# Altium schematic sheet Esp8266.SchDoc
size A3; SheetNumber: 5; SheetTotal: 8
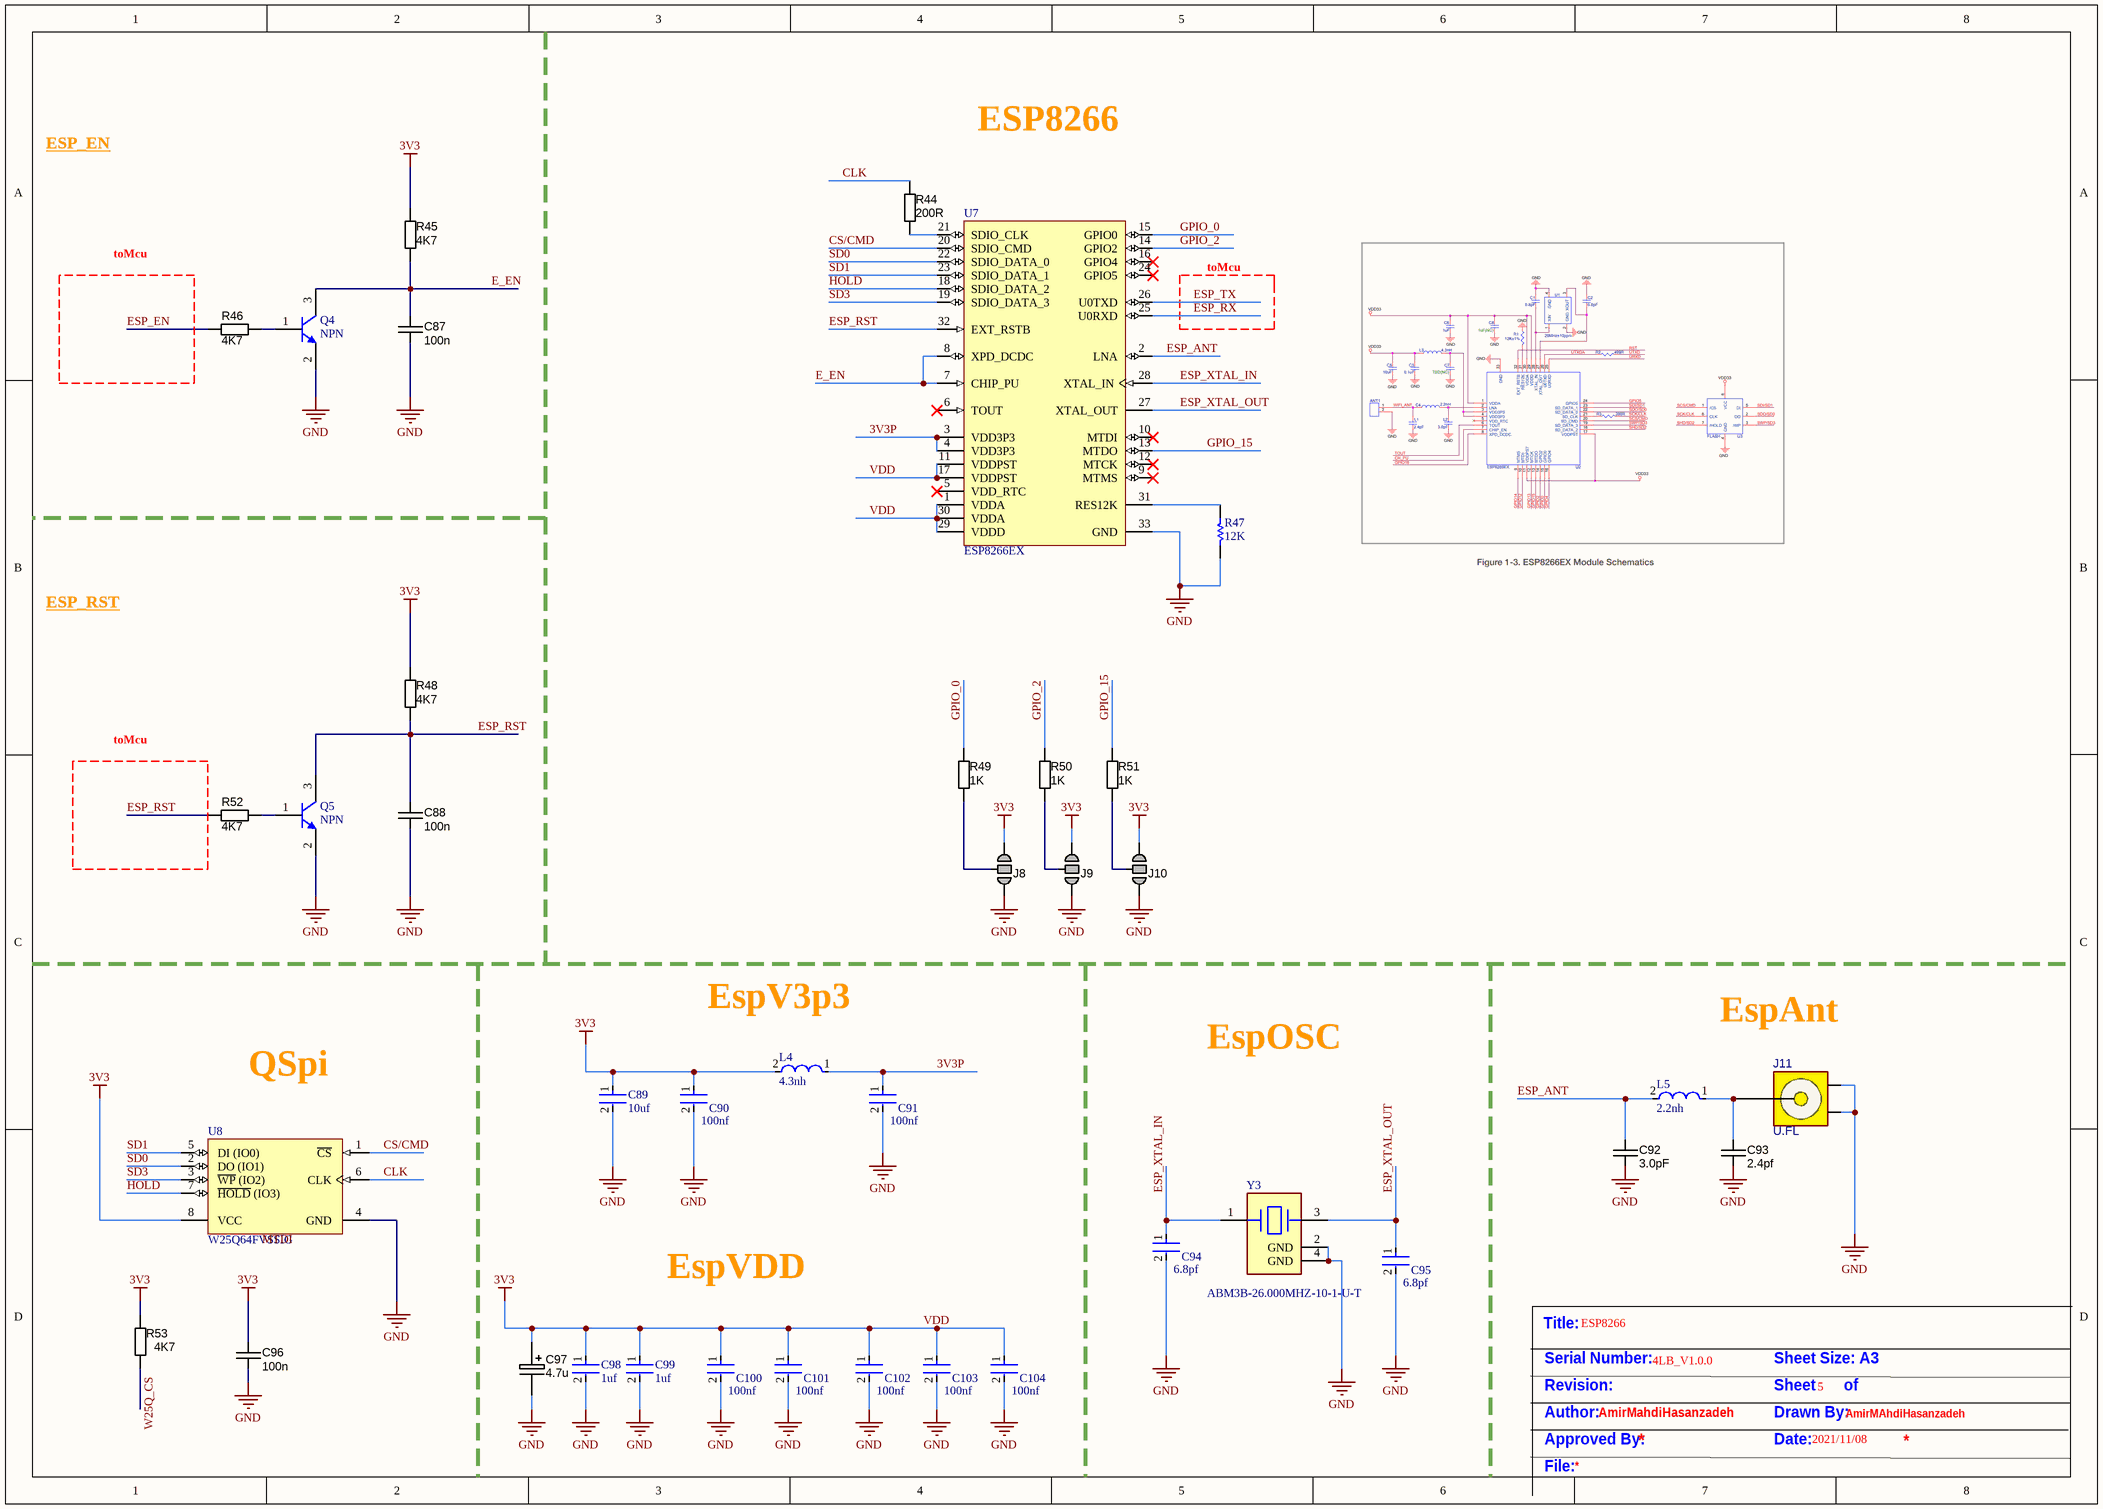
[diagram p0: Esp8266.SchDoc]

## Parts
C87  value 100n  [CAPC1608X90N]  (hidden comment: approved sub OK)
C88  value 100n  [CAPC1608X90N]  (hidden comment: approved sub OK)
C89  10uf  [FP-GRM31C-0_2-e0_3_0_8-MFG]
C90  100nf  [FP-CGA3E-0_3-0_1-IPC_A]
C91  100nf  [FP-CGA3E-0_3-0_1-IPC_A]
C92  3.0pF  [C0402]
C93  value 2.4pf  [C0402]  (hidden comment: approved sub OK)
C94  6.8pf  [FP-CGA3E-0_3-0_1-IPC_A]
C95  6.8pf  [FP-CGA3E-0_3-0_1-IPC_A]
C96  value 100n  [CAPC1608X90N]  (hidden comment: approved sub OK)
C97  value 4.7u  [C_TN_3528]
C98  1uf  [FP-GRM31C-0_2-e0_3_0_8-MFG]
C99  1uf  [FP-GRM31C-0_2-e0_3_0_8-MFG]
C100  100nf  [FP-CGA3E-0_3-0_1-IPC_A]
C101  100nf  [FP-CGA3E-0_3-0_1-IPC_A]
C102  100nf  [FP-CGA3E-0_3-0_1-IPC_A]
C103  100nf  [FP-CGA3E-0_3-0_1-IPC_A]
C104  100nf  [FP-CGA3E-0_3-0_1-IPC_A]
J8  Jumper  [Jump_3Way]  (value not drawn)  (no BOM)
J9  Jumper  [Jump_3Way]  (value not drawn)  (no BOM)
J10  Jumper  [Jump_3Way]  (value not drawn)  (no BOM)
J11  U.FL  [UFL]
L4  4.3nh  [FP-CBMF1608-MFG]
L5  2.2nh  [FP-CBMF1608-MFG]
Q4  NPN  [SOT23-3]
Q5  NPN  [SOT23-3]
R44  value 200R  [RESC1608X55N]  (hidden comment: Thick Film)
R45  value 4K7  [RESC1608X55N]  (hidden comment: Thick Film)
R46  value 4K7  [RESC1608X55N]  (hidden comment: Thick Film)
R47  12K  [RESC1608X55X25ML10T15]
R48  value 4K7  [RESC1608X55N]  (hidden comment: Thick Film)
R49  value 1K  [RESC1608X55N]  (hidden comment: Thick Film)
R50  value 1K  [RESC1608X55N]  (hidden comment: Thick Film)
R51  value 1K  [RESC1608X55N]  (hidden comment: Thick Film)
R52  value 4K7  [RESC1608X55N]  (hidden comment: Thick Film)
R53  value 4K7  [RESC1608X55N]  (hidden comment: Thick Film)
U7  ESP8266EX  [ESFS-QFN-32_L]
U8  W25Q64FVSSIG  [WINB-SOIC-8_M]
Y3  ABM3B-26.000MHZ-10-1-U-T  [FP-ABM3B-MFG]

## Nets
GND: C87.2 C88.2 C89.2 C90.2 C91.2 C92.2 C93.2 C94.2 C95.2 C96.2 C97.2 C98.2 C99.2 C100.2 C101.2 C102.2 C103.2 C104.2 J8.1 J9.1 J10.1 J11.2(G1) J11.3(G2) Q4.2(E) Q5.2(E) R47.1 U7.33(GND) U8.4(GND) Y3.2(GND) Y3.4(GND)
VDD: C89.1 C90.1 C96.1 C97.1 C98.1 C99.1 C100.1 C101.1 C102.1 C103.1 C104.1 J8.3 J9.3 J10.3 L4.2 R45.1 R48.1 R53.1 U7.1(VDDA) U7.11(VDDPST) U7.17(VDDPST) U7.29(VDDD) U7.30(VDDA) U8.8(VCC)  [also labelled 3V3]
3V3P: C91.1 L4.1 U7.3(VDD3P3) U7.4(VDD3P3)
CLK: R44.2 U8.6(CLK)
CS/CMD: U7.20(SDIO_CMD) U8.1(~{CS})
E_EN: C87.1 Q4.3(C) R45.2 U7.7(CHIP_PU) U7.8(XPD_DCDC)
ESP_ANT: C92.1 L5.2 U7.2(LNA)
ESP_EN: R46.1
ESP_RST: C88.1 Q5.3(C) R48.2 R52.1 U7.32(EXT_RSTB)
ESP_RX: U7.25(U0RXD)
ESP_TX: U7.26(U0TXD)
ESP_XTAL_IN: C94.1 U7.28(XTAL_IN) Y3.1
ESP_XTAL_OUT: C95.1 U7.27(XTAL_OUT) Y3.3
GPIO_0: R49.1 U7.15(GPIO0)
GPIO_2: R50.1 U7.14(GPIO2)
GPIO_15: R51.1 U7.13(MTDO)
HOLD: U7.18(SDIO_DATA_2) U8.7(~{HOLD}_(IO3))
SD0: U7.22(SDIO_DATA_0) U8.2(DO_(IO1))
SD1: U7.23(SDIO_DATA_1) U8.5(DI_(IO0))
SD3: U7.19(SDIO_DATA_3) U8.3(~{WP}_(IO2))
W25Q_CS: R53.2
NetC93_1: C93.1 J11.1(SIG) L5.1
NetJ8_2: J8.2 R49.2
NetJ9_2: J9.2 R50.2
NetJ10_2: J10.2 R51.2
NetQ4_1: Q4.1(B) R46.2
NetQ5_1: Q5.1(B) R52.2
NetR44_1: R44.1 U7.21(SDIO_CLK)
NetR47_2: R47.2 U7.31(RES12K)

Not connected (* = marked no-connect by the designer): U7 5(VDD_RTC)* 6(TOUT)* 9(MTMS)* 10(MTDI)* 12(MTCK)* 16(GPIO4)* 24(GPIO5)*

## Notes on the sheet
- ESP_EN
- ESP8266
- toMcu
- ESP_RST
- EspV3p3
- EspOSC
- EspAnt
- QSpi
- EspVDD
- Labels drawn without touching a wire or pin: MTDI
- Title:
- Serial Number:
- Revision:
- 4LB_V1.0.0
- Sheet       of
- Sheet Size: A3
- 5
- Author:
- Approved By:
- AmirMahdiHasanzadeh
- Date:
- Drawn By:
- 2021/11/08
- AmirMAhdiHasanzadeh
- File:

## Library data of the parts
C87 C88 C93 C96 = CAPC_100n_0603_X7R_50V_10%: Capacitor SMD Cer 100nF 10% 50V X7R 0603; Manufacturer 1: AVX Corporation; Manufacturer Part Number 1: 06035C104KAT2A; Ratings: 50V; X7R; Material: ceramic; SCDType: spec; Manufacturer 2: TDK Corporation; Manufacturer Part Number 2: C1608X7R1H104K; Package / Case: 0603 (1608 Metric); Tolerance: ±10%; Supplier 1: Digi-Key; Supplier Part Number 1: 478-5052-1-ND; ComponentLink1URL: http://www.avx.com/docs/Catalogs/cx7r.pdf; ComponentLink1Description: http://www.avx.com/docs/Catalogs/cx7r.pdf; Supplier 2: Digi-Key; Supplier Part Number 2: 445-1314-1-ND; ComponentLink2URL: http://product.tdk.com/capacitor/mlcc/en/documents/mlcc_commercial_general_en.pdf; ComponentLink2Description: http://product.tdk.com/capacitor/mlcc/en/documents/mlcc_commercial_general_en.pdf
C89 C98 C99 = CMP-06035-003841-1: Chip Multilayer Ceramic Capacitors for General Purpose, 1206, 10uF, X7R, 15%, 10%, 10V; Capacitance: 22uF; Height: 1.6mm; Width: 0.063inch; Min Operating Temperature: -55°C; Package Quantity: 1; Termination: SMD/SMT; Length: 3.2mm; Voltage Rating: 10V; Case/Package: 1206; Case Code (Imperial): 1206; Depth: 1.6mm; Dielectric: X7R; Voltage: 10V; Material: Ceramic; Tolerance: 10%; Voltage Rating (DC): 10V; Lead Free: Lead Free; Max Operating Temperature: 125°C; Case Code (Metric): 3216; Packaging: Tape and Reel; Thickness: 0.071inch; Radiation Hardening: No; REACH SVHC: No SVHC; Mount: Surface Mount
C90 C91 C94 C95 C100-C104 = CMP-2000-07546-2: Cap Ceramic 100nF 50V X7R 10% Pad SMD 0603 +125°C Automotive T/R; Weight: 7.1E-05oz; Composition: Ceramic; Max Operating Temperature: 125°C; Termination: SMD/SMT; Dielectric: X7R; Length: 1.6mm; Package Quantity: 1; REACH SVHC: No SVHC; Lead Free: Lead Free; Case Code (Metric): 1608; Min Operating Temperature: -55°C; Packaging: Tape and Reel; Tolerance: 10%; Voltage Rating: 50V; Case Code (Imperial): 0603; Capacitance: 100nF; Case/Package: 0603; Voltage Rating (DC): 50V; Depth: 0.8mm; Radiation Hardening: No; Ratings: AEC-Q200; Mount: Surface Mount; Voltage: 50V; Thickness: 0.035inch; Width: 0.8mm; Height: 0.8mm
C92 = CAPC_100n_0603_X7R_50V_10%: Capacitor SMD Cer 3.0pF 10% 50V X7R 0603; Manufacturer 1: AVX Corporation; Manufacturer Part Number 1: 06035C104KAT2A; Ratings: 50V; X7R; Material: ceramic; SCDType: spec; Manufacturer 2: TDK Corporation; Manufacturer Part Number 2: C1608X7R1H104K; Package / Case: 0603 (1608 Metric); Tolerance: ±10%; Supplier 1: Digi-Key; Supplier Part Number 1: 478-5052-1-ND; ComponentLink1URL: http://www.avx.com/docs/Catalogs/cx7r.pdf; ComponentLink1Description: http://www.avx.com/docs/Catalogs/cx7r.pdf; Supplier 2: Digi-Key; Supplier Part Number 2: 445-1314-1-ND; ComponentLink2URL: http://product.tdk.com/capacitor/mlcc/en/documents/mlcc_commercial_general_en.pdf; ComponentLink2Description: http://product.tdk.com/capacitor/mlcc/en/documents/mlcc_commercial_general_en.pdf; Value: 3.0pF
C97 = CAPT_4u7_3216_16V: Capacitor SMD Tantalum 10uF 10% 16V 3216-18; Manufacturer 1: Vishay/Sprague; Manufacturer Part Number 1: 293D475X9016A2TE3; SCDType: undef; Package / Case: EIA 535BAAC size A; Ratings: 16V; Tolerance: ±10%; Material: Tantalum; Supplier 1: Digi-Key; Supplier Part Number 1: 718-1148-1-ND
J8-J10 = JUMP_3WAY: SMD jumper
J11 = CONN_RF_UFL: CONN, RF, U.FL, STRAIGHT, Ultra Miniature Coaxial; MANF_P#: CONUFL001-SMD, U.FL-R-SMT-1(10), 128-0711-201; MANF: Linx, Hirose, Cinch; PARAM: 50Ohm, 6GHz; DESC: DESCRIPTION; DIST#: DIGIKEY, MOUSER; PARAM2: GOLD; ASSEMBLY: ASSEMBLY; PRICE: 0.9$; VALUE: U.FL
L4 = CMP-14484-000379-1: SMD Inductors 4.3nH ±20% 0.56A 0.221Ω 0603; Core Material: Ferrite; Shielding: Unshielded; DC Resistance (DCR): 221mR; Current Rating: 560mA; Test Frequency: 7.96MHz; Saturation Current: 190mA; Inductance: 2.2uH; Self Resonant Frequency: 80MHz; Packaging: Tape and Reel; Tolerance: 20%; Width: 0.8mm; Length: 1.6mm; Min Operating Temperature: -40°C; RoHS Compliant: Yes; Halogen Free: Halogen Free; Height: 0.8mm; Package Quantity: 1; Mount: Surface Mount; Depth: 1mm; Height - Seated (Max): 0.039inch; Case Code (Metric): 1608; Series: CBMF; Termination: SMD/SMT; Case Code (Imperial): 0603; Military Standard: Not; Max DC Current: 560mA; Case/Package: 0603; Resistor Type: Wirewound; Radiation Hardening: No; Lead Free: Lead Free; Inductance Tolerance: 20%; DC Current: 560mA; Max Operating Temperature: 105°C
L5 = CMP-14484-000379-1: SMD Inductors 2.2nH ±20% 0.56A 0.221Ω 0603; Core Material: Ferrite; Shielding: Unshielded; DC Resistance (DCR): 221mR; Current Rating: 560mA; Test Frequency: 7.96MHz; Saturation Current: 190mA; Inductance: 2.2uH; Self Resonant Frequency: 80MHz; Packaging: Tape and Reel; Tolerance: 20%; Width: 0.8mm; Length: 1.6mm; Min Operating Temperature: -40°C; RoHS Compliant: Yes; Halogen Free: Halogen Free; Height: 0.8mm; Package Quantity: 1; Mount: Surface Mount; Depth: 1mm; Height - Seated (Max): 0.039inch; Case Code (Metric): 1608; Series: CBMF; Termination: SMD/SMT; Case Code (Imperial): 0603; Military Standard: Not; Max DC Current: 560mA; Case/Package: 0603; Resistor Type: Wirewound; Radiation Hardening: No; Lead Free: Lead Free; Inductance Tolerance: 20%; DC Current: 560mA; Max Operating Temperature: 105°C
Q4 Q5 = NPN: NPN Bipolar Transistor; Published: 8-Jun-2000; LatestRevisionDate: 17-Jul-2002; LatestRevisionNote: Re-released for DXP Platform.; PackageReference: TO-226-AA; Publisher: Altium Limited; PackageDescription: TO, Flat Index; 3 In-Line, Axial Leads; Body Dia. 4.8mm; Leads 0.55 x 0.51 mm (max); Code_JEDEC: TO-226-AA
R44-R46 R48 R52 R53 = RES_4K7_0603_5%: Resistor SMD chip 4.7k Ohm 0.1W 5% 0603; Manufacturer 1: Vishay/Dale; Manufacturer Part Number 1: CRCW06034K70JNEA; Ratings: 1/10 W; SCDType: spec; Package / Case: 0603 (1608 metric); Tolerance: ±5%; Material: Thick Film; Supplier 1: Digi-Key; Supplier Part Number 1: 541-4.7KGCT-ND
R47 = CMP-2100-03667-1: Chip Resistor, 0 Ohm, +/- 5%, 0.1 W, -55 to 155 degC, 0603 (1608 Metric), RoHS, Tape and Reel; Manufacturer: Yageo; Temperature Coefficient: 200ppm/degreesC; Voltage Rating: 50V; Power Rating: 100mW; Resistance: 0mOhm; Width: 0.8mm; Max Operating Temperature: 155degC; Tolerance: 5%; Package Reference: 0603; Height: 0.45mm; Depth: 0.8mm; Package Description: 2-Pin Surface Mount Device, Body 1.6 x 0.8 mm; Termination: SMD/SMT; Package Quantity: 5000; Case/Package: 0603; Case Code (Imperial): 0603; Radiation Hardening: No; Number of Pins: 2; Length: 1.6mm; Lead Free: LeadFree; Voltage Rating (DC): 50V; Military Standard: Not; Datasheet URL: http://www.yageo.com/NewPortal/yageodocoutput?fileName=/pdf/R-Chip/PYu-RC_Group_51_RoHS_L_5.pdf; Manufacturer URL: http://www.yageo.com/; Packaging: TapeandReel; Case Code (Metric): 1608; Min Operating Temperature: -55degC; Composition: ThickFilm; RoHSCompliant: true; Contact Plating: Tin; Datasheet Version: Rev. 5, 10/2016; REACH SVHC: NoSVHC
R49-R51 = RES_4K7_0603_5%: Resistor SMD chip 1k Ohm 0.1W 5% 0603; Manufacturer 1: Vishay/Dale; Manufacturer Part Number 1: CRCW06034K70JNEA; Ratings: 1/10 W; SCDType: spec; Package / Case: 0603 (1608 metric); Tolerance: ±5%; Material: Thick Film; Supplier 1: Digi-Key; Supplier Part Number 1: 541-4.7KGCT-ND
U7 = CMP-2000-07453-1: Low-Power, Highly-Integrated Wi-Fi Solution, 2.5 to 3.6 V, 80 mA, -40 to 125 degC, 32-Pin QFN; Manufacturer: Espressif Systems; Mounting Technology: SurfaceMount; Datasheet URL: http://espressif.com/sites/default/files/documentation/0a-esp8266ex_datasheet_en.pdf; Package Reference: QFN-32; Package Description: 32-Pin Quad Falt No-Lead, Body 5 x 5 mm, Pitch 0.5 mm; Manufacturer URL: http://espressif.com; Datasheet Version: Rev. 5.4, 04/2017
U8 = CMP-2000-05007-1: 3V 64M-Bit Serial Flash Memory with Dual/Quad SPI & QPI, 2.7 to 3.6 V, -40 to 85 degC, 8-Pin SOIC, RoHS, Tape and Reel; Manufacturer: Winbond; Boot Type: Bottom/Top; Word Size: 8b; Cell Type: NOR; Operating Supply Voltage (Min): 2.7V; Operating Supply Voltage (Max): 3.6V; Rad Hardened: No; Density: 67108864Bit; Address Bus: 1b; Supply Current: 40mA; Sync/Async: Synchronous; Number of Words: 8M; Programmable: Yes; Operating Supply Voltage (Typ): 3/3.3V; Access Time (Max): 8.5ns; Interface Type: Serial(SPI); Operating Temperature Classification: Industrial; Datasheet Version: Rev. D, 12/2011; Operating Temp Range: -40Cto85C; Operating Temperature (Max): 85C; Pin Count: 8; Mounting: SurfaceMount; Program/Erase Volt (Typ): 2.7to3.6V; Operating Temperature (Min): -40C; Package Description: 8-Pin Small Outline Integrated Circuit, Body 5.28 x 5.28 mm, Pitch 1.27 mm; Datasheet URL: https://datasheet.ciiva.com/15126/getdatasheetpartid-552937-15126648.pdf; Package Reference: SS-8; Manufacturer URL: http://www.winbond.com/hq/index.html?__locale=en; Package Type: SOIC
Y3 = CMP-27762-000013-1: CRYSTAL 26.0000MHZ 10PF SMD; Manufacturer: Abracon; Tolerance: 10ppm; Esr: 50Ω; Frequency: 26MHz; Mouser Description: Crystal 26MHz ±10ppm (Tol) ±10ppm (Stability) 10pF FUND 50Ohm 4-Pin CSMD T/R; Load Capacitance: 10pF; RoHS: TRUE; Device Class L1: Passive Components; Height: 1.1mm; ComponentLink2URL: http://www.abracon.com/Resonators/abm3b.pdf; Octopart: https://octopart.com/abm3b-26.000mhz-10-1-u-t-abracon-315160; Manufacturer Part Number: ABM3B-26.000MHZ-10-1-U-T; Temperature Range Low: -10°C; ComponentLink2Description: Datasheet; Temperature: -10°C to +60°C; Device Class L2: Crystals / Oscillators; Device Class L3: Crystals; Series: ABM3B; Lead Free: Yes; Digikey Description: CRYSTAL 26.0000MHZ 10PF SMD; Temperature Range High: +60°C; Package: ABM3B; Automotive: No; Category: Crys; Stability: 10ppm